# Altium schematic sheet USB-HUB-H.schdoc
size 604 x 431 mm; Symbol: Sheet-Symbol_A0; Device: Sheet-Symbol_A0; @Page Name: USB-HUB-H; @Create Date: 2023-08-03; @Page Count: 1; @Page No: 1; @Project Name: USB-HUB-H; @Schematic Name: Schematic1; @Update Date: 2023-09-07; Company: Drawn by Mr.HanXianzhi; Page Size: A2; Version: V1.0
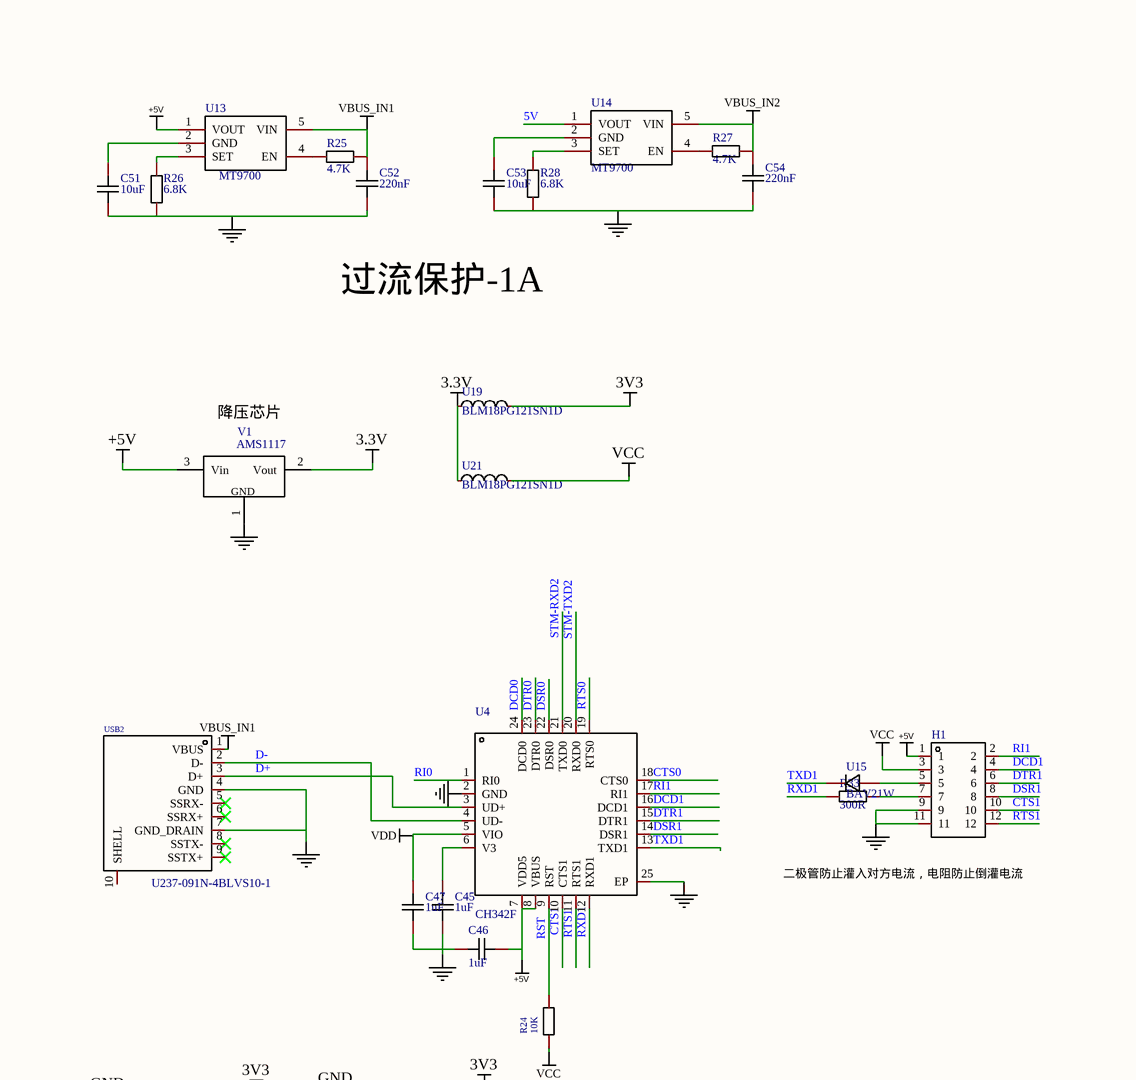
[diagram p0: USB-HUB-H.schdoc, top left]
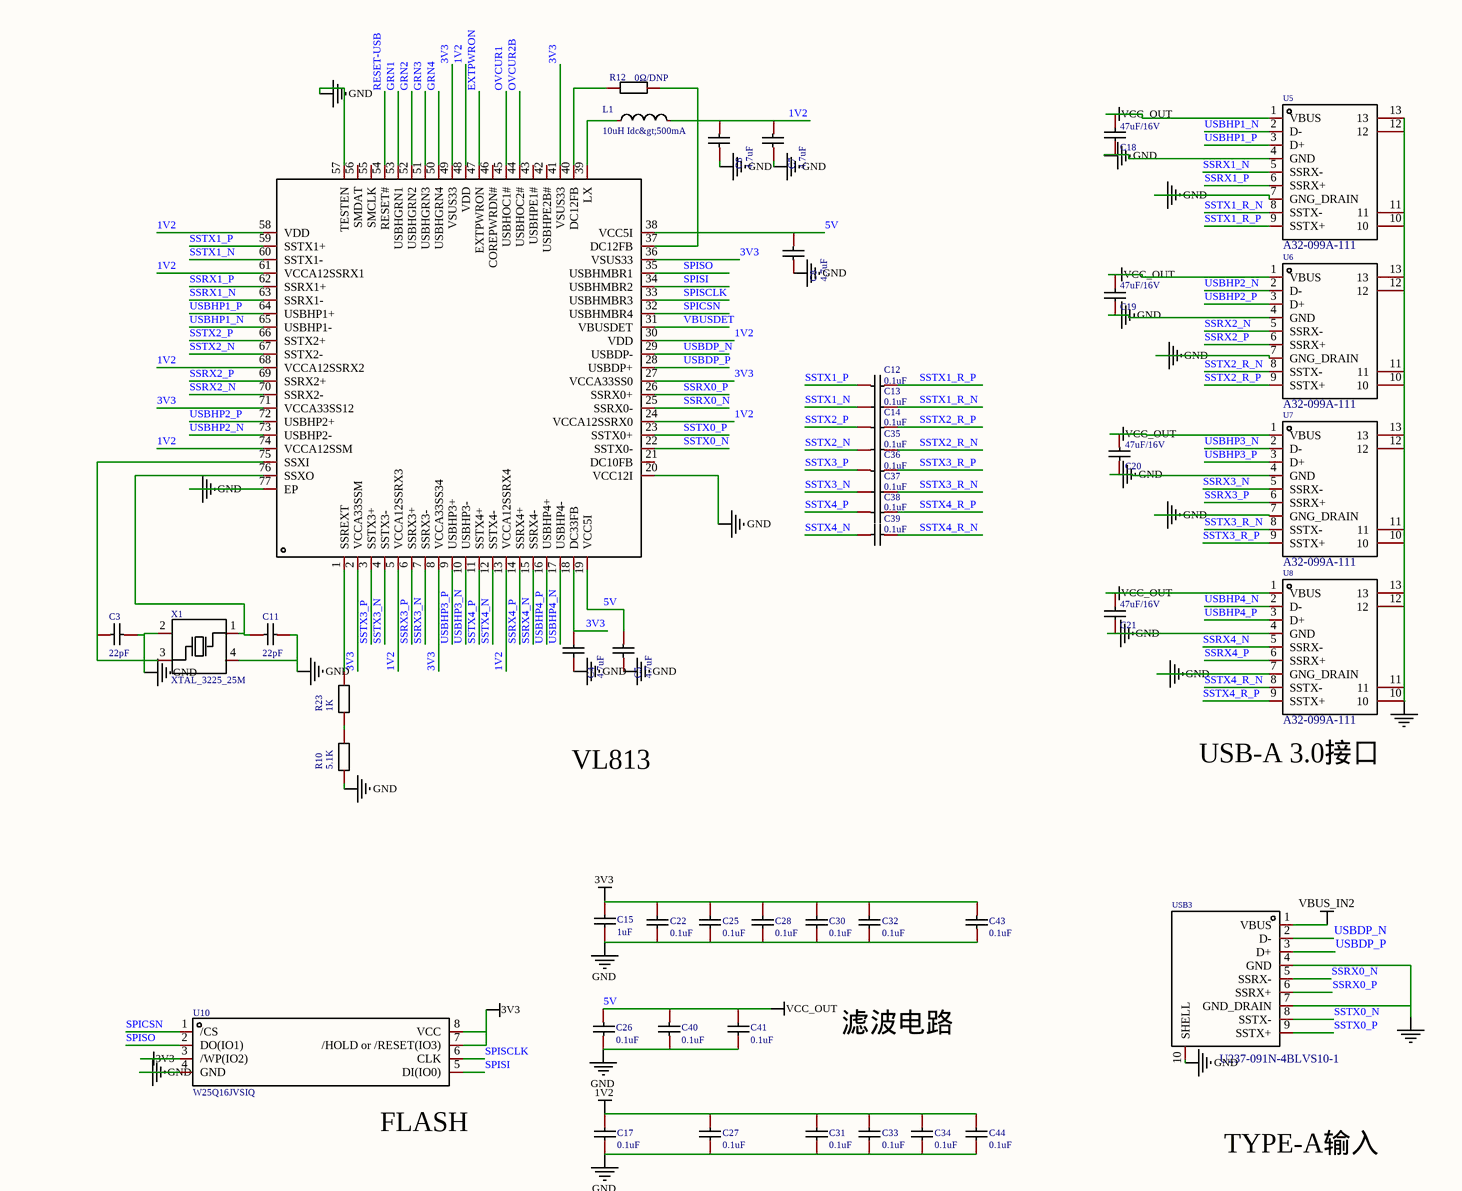
[diagram p1: USB-HUB-H.schdoc, top right]
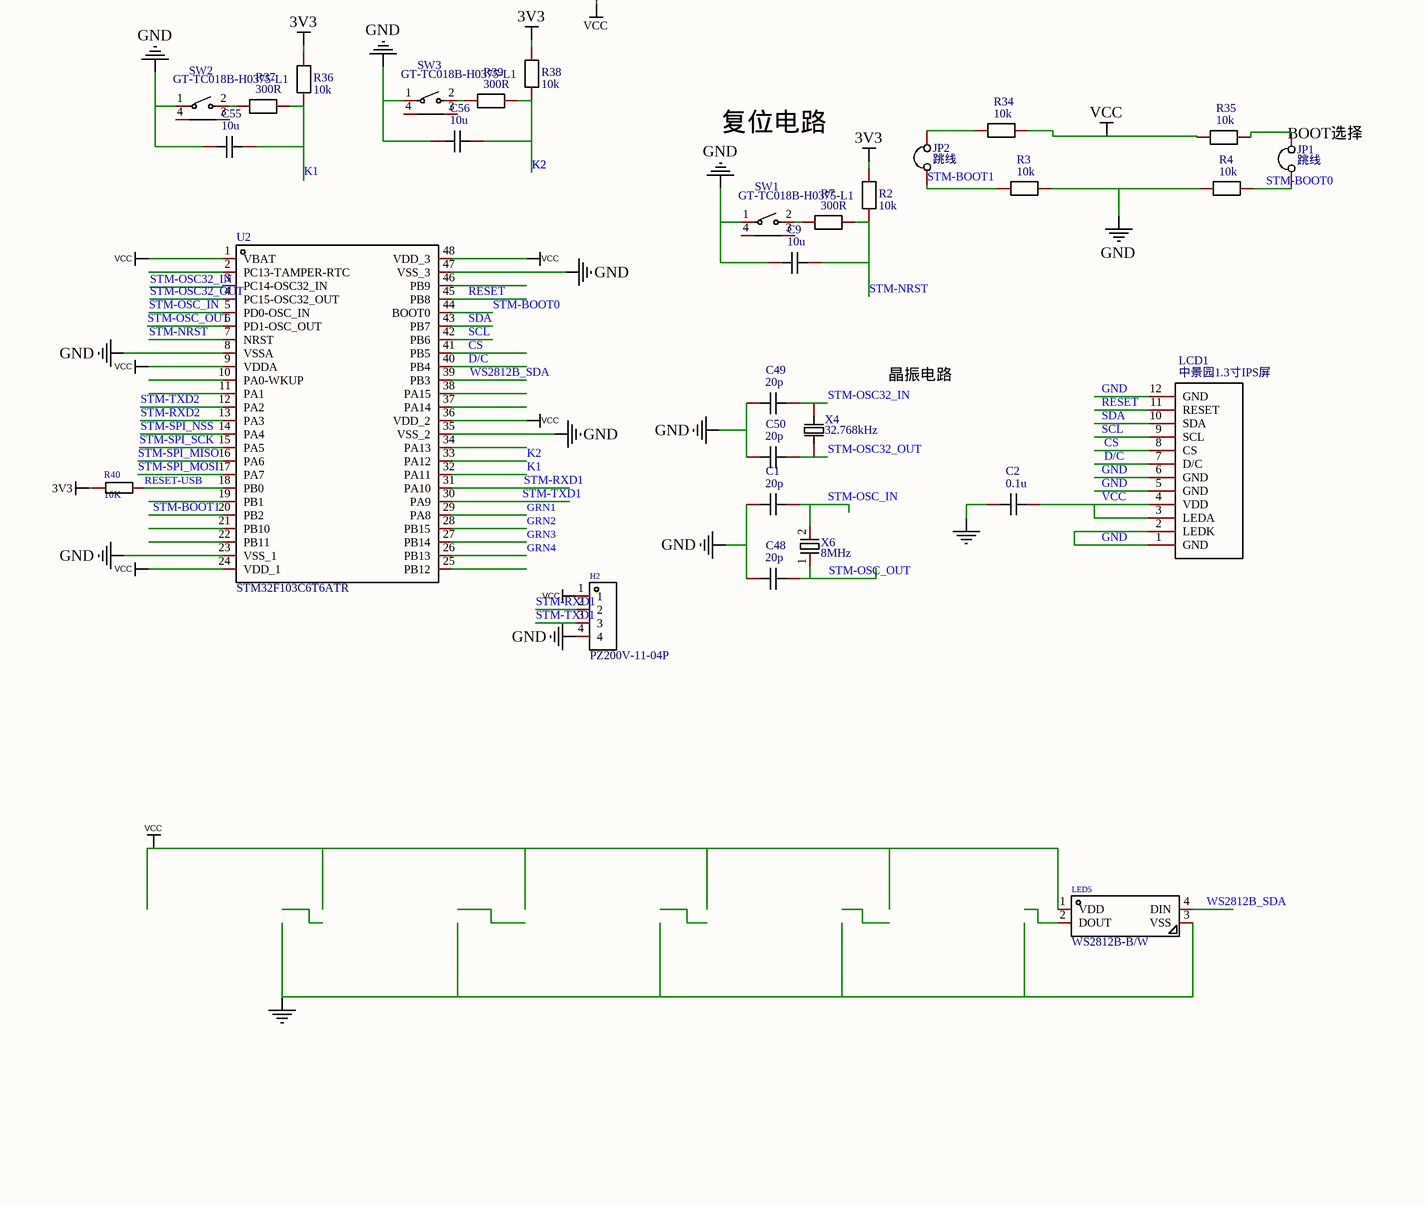
[diagram p2: USB-HUB-H.schdoc, bottom left]
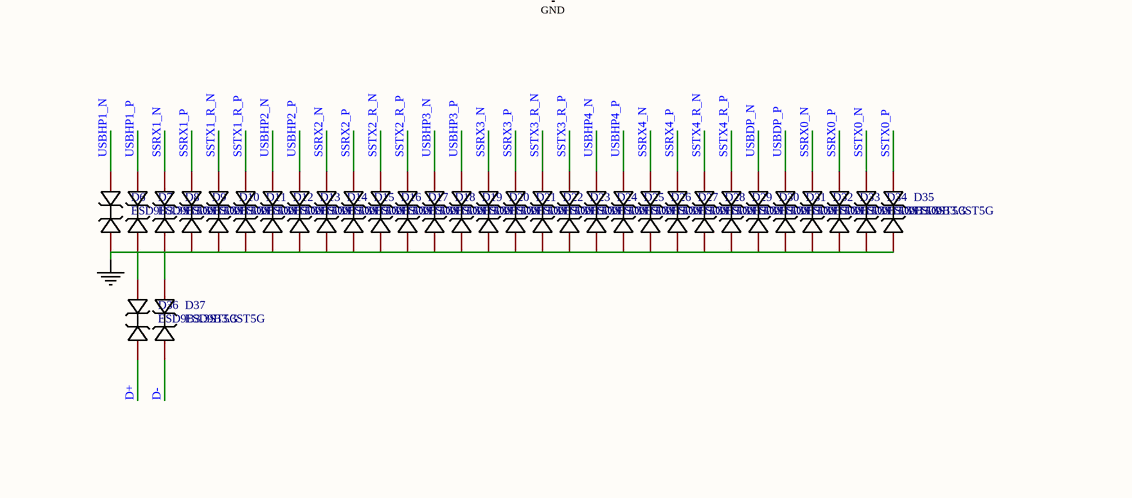
[diagram p3: USB-HUB-H.schdoc, bottom right]

## Parts
C1  20p  [C0603-S]
C2  0.1u  [C0603-S]
C3  22pF  [C0603-S]
C4  4.7uF  [C0603-S]
C5  4.7uF  [C0603-S]
C6  4.7uF  [C0603-S]
C7  4.7uF  [C0603-S]
C8  4.7uF  [C0603-S]
C9  10u  [C0603-S]
C11  22pF  [C0603-S]
C12  0.1uF  [C0603-S]
C13  0.1uF  [C0603-S]
C14  0.1uF  [C0603-S]
C15  1uF  [C0603-S]
C17  0.1uF  [C0603-S]
C18  47uF/16V  [C0603-S]
C19  47uF/16V  [C0603-S]
C20  47uF/16V  [C0603-S]
C21  47uF/16V  [C0603-S]
C22  0.1uF  [C0603-S]
C25  0.1uF  [C0603-S]
C26  0.1uF  [C0603-S]
C27  0.1uF  [C0603-S]
C28  0.1uF  [C0603-S]
C30  0.1uF  [C0603-S]
C31  0.1uF  [C0603-S]
C32  0.1uF  [C0603-S]
C33  0.1uF  [C0603-S]
C34  0.1uF  [C0603-S]
C35  0.1uF  [C0603-S]
C36  0.1uF  [C0603-S]
C37  0.1uF  [C0603-S]
C38  0.1uF  [C0603-S]
C39  0.1uF  [C0603-S]
C40  0.1uF  [C0603-S]
C41  0.1uF  [C0603-S]
C43  0.1uF  [C0603-S]
C44  0.1uF  [C0603-S]
C45  1uF  [C0603-S]
C46  1uF  [C0603-S]
C47  1uF  [C0603-S]
C48  20p  [C0603-S]
C49  20p  [C0603-S]
C50  20p  [C0603-S]
C51  10uF  [C0603-S]
C52  220nF  [C0603-S]
C53  10uF  [C0603-S]
C54  220nF  [C0603-S]
C55  10u  [C0603-S]
C56  10u  [C0603-S]
D6  ESD9B3.3ST5G  [SOD-923_L0.8-W0.6-LS1.0-BI-1]
D7  ESD9B3.3ST5G  [SOD-923_L0.8-W0.6-LS1.0-BI-1]
D8  ESD9B3.3ST5G  [SOD-923_L0.8-W0.6-LS1.0-BI-1]
D9  ESD9B3.3ST5G  [SOD-923_L0.8-W0.6-LS1.0-BI-1]
D10  ESD9B3.3ST5G  [SOD-923_L0.8-W0.6-LS1.0-BI-1]
D11  ESD9B3.3ST5G  [SOD-923_L0.8-W0.6-LS1.0-BI-1]
D12  ESD9B3.3ST5G  [SOD-923_L0.8-W0.6-LS1.0-BI-1]
D13  ESD9B3.3ST5G  [SOD-923_L0.8-W0.6-LS1.0-BI-1]
D14  ESD9B3.3ST5G  [SOD-923_L0.8-W0.6-LS1.0-BI-1]
D15  ESD9B3.3ST5G  [SOD-923_L0.8-W0.6-LS1.0-BI-1]
D16  ESD9B3.3ST5G  [SOD-923_L0.8-W0.6-LS1.0-BI-1]
D17  ESD9B3.3ST5G  [SOD-923_L0.8-W0.6-LS1.0-BI-1]
D18  ESD9B3.3ST5G  [SOD-923_L0.8-W0.6-LS1.0-BI-1]
D19  ESD9B3.3ST5G  [SOD-923_L0.8-W0.6-LS1.0-BI-1]
D20  ESD9B3.3ST5G  [SOD-923_L0.8-W0.6-LS1.0-BI-1]
D21  ESD9B3.3ST5G  [SOD-923_L0.8-W0.6-LS1.0-BI-1]
D22  ESD9B3.3ST5G  [SOD-923_L0.8-W0.6-LS1.0-BI-1]
D23  ESD9B3.3ST5G  [SOD-923_L0.8-W0.6-LS1.0-BI-1]
D24  ESD9B3.3ST5G  [SOD-923_L0.8-W0.6-LS1.0-BI-1]
D25  ESD9B3.3ST5G  [SOD-923_L0.8-W0.6-LS1.0-BI-1]
D26  ESD9B3.3ST5G  [SOD-923_L0.8-W0.6-LS1.0-BI-1]
D27  ESD9B3.3ST5G  [SOD-923_L0.8-W0.6-LS1.0-BI-1]
D28  ESD9B3.3ST5G  [SOD-923_L0.8-W0.6-LS1.0-BI-1]
D29  ESD9B3.3ST5G  [SOD-923_L0.8-W0.6-LS1.0-BI-1]
D30  ESD9B3.3ST5G  [SOD-923_L0.8-W0.6-LS1.0-BI-1]
D31  ESD9B3.3ST5G  [SOD-923_L0.8-W0.6-LS1.0-BI-1]
D32  ESD9B3.3ST5G  [SOD-923_L0.8-W0.6-LS1.0-BI-1]
D33  ESD9B3.3ST5G  [SOD-923_L0.8-W0.6-LS1.0-BI-1]
D34  ESD9B3.3ST5G  [SOD-923_L0.8-W0.6-LS1.0-BI-1]
D35  ESD9B3.3ST5G  [SOD-923_L0.8-W0.6-LS1.0-BI-1]
D36  ESD9B3.3ST5G  [SOD-923_L0.8-W0.6-LS1.0-BI-1]
D37  ESD9B3.3ST5G  [SOD-923_L0.8-W0.6-LS1.0-BI-1]
H1  HDR-M_2.54_2x6  [2.54-2*12pin-SMD]  (value not drawn)
H2  PZ200V-11-04P  [HDR-TH_4P-P2.00-V-M]
JP1  跳线  [JUMPER2]
JP2  跳线  [JUMPER2]
L1  10uH Idc&gt;500mA  [L0603]
LCD1  中景园1.3寸IPS屏  [中景园1.3寸IPS屏-原版]
LED5  WS2812B-B/W  [LED-SMD_4P-L5.0-W5.0-BL_TC5050RGB]
R2  10k  [R0603-S]
R3  10k  [R0603-S]
R4  10k  [R0603-S]
R7  300R  [R0603-S]
R10  5.1K  [R0603-S]
R12  0Ω/DNP  [R0603-S]
R23  1K  [R0603-S]
R24  10K  [R0603-S]
R25  4.7K  [R0603-S]
R26  6.8K  [R0603-S]
R27  4.7K  [R0603-S]
R28  6.8K  [R0603-S]
R33  300R  [R0603-S]
R34  10k  [R0603-S]
R35  10k  [R0603-S]
R36  10k  [R0603-S]
R37  300R  [R0603-S]
R38  10k  [R0603-S]
R39  300R  [R0603-S]
R40  10K  [R0603-S]
SW1  GT-TC018B-H0375-L1  [SW-SMD_L4.7-W3.5-P3.35-EH]
SW2  GT-TC018B-H0375-L1  [SW-SMD_L4.7-W3.5-P3.35-EH]
SW3  GT-TC018B-H0375-L1  [SW-SMD_L4.7-W3.5-P3.35-EH]
U2  STM32F103C6T6ATR  [LQFP-48_L7.0-W7.0-P0.50-LS9.0-BL]
U4  CH342F  [VQFN-24_L4.0-W4.0-P0.50-TL-EP2.4]
U5  A32-099A-111  [USB-SMD_A32-099A-111]
U6  A32-099A-111  [USB-SMD_A32-099A-111]
U7  A32-099A-111  [USB-SMD_A32-099A-111]
U8  A32-099A-111  [USB-SMD_A32-099A-111]
U9  VL813(A1)  [VL813 QFN-76 02]  (value not drawn)
U10  W25Q16JVSIQ  [W25Q16]
U13  MT9700  [SOT-23-5_L3.0-W1.7-P0.95-LS2.8-BR]
U14  MT9700  [SOT-23-5_L3.0-W1.7-P0.95-LS2.8-BR]
U15  BAV21W  [SOD-123_L2.7-W1.6-LS3.8-RD]
U19  BLM18PG121SN1D  [L0603]
U21  BLM18PG121SN1D  [L0603]
USB2  U237-091N-4BLVS10-1  [USB3.0-A-SMD_U237-091N-4BLVS10-1]
USB3  U237-091N-4BLVS10-1  [USB3.0-A-SMD_U237-091N-4BLVS10-1]
V1  AMS1117  [SOT89_N]
X1  XTAL_3225_25M  [SMD-4_3225-ACM3225]
X4  32.768kHz  [FC-135R_L3.2-W1.5]
X6  8MHz  [CRYSTAL-SMD_L5.0-W3.2]

## Nets
1V2: C6.1 C7.1 C17.1 C27.1 C31.1 C33.1 C34.1 C44.1 L1.2 R12.1 U9.5(VCCA12SSRX3) U9.13(VCCA12SSRX4) U9.24(VCCA12SSRX0) U9.30(VDD) U9.37(DC12FB) U9.48(VDD) U9.58(VDD) U9.61(VCCA12SSRX1) U9.68(VCCA12SSRX2) U9.74(VCCA12SSM)
3.3V: U19.1 U21.1 V1.2(Vout)
3V3: C4.1 C15.1 C22.1 C25.1 C28.1 C30.1 C32.1 C43.1 R2.2 R36.2 R38.2 R40.2 U9.2(VCCA33SSM) U9.8(VCCA33SS34) U9.18(DC33FB) U9.27(VCCA33SS0) U9.36(VSUS33) U9.41(VSUS33) U9.49(VSUS33) U9.71(VCCA33SS12) U10.3(/WP(IO2)) U10.7(/HOLD_or_/RESET(IO3)) U10.8(VCC) U19.2
5V: C5.1 C8.1 C18.1 C19.1 C20.1 C21.1 C26.1 C40.1 C41.1 U5.1(VBUS) U6.1(VBUS) U7.1(VBUS) U8.1(VBUS) U9.19(VCC5I) U9.38(VCC5I) U14.1(VOUT)  [also labelled VCC_OUT]
+5V: C46.1 H1.1 U4.7(VDD5) U4.8(VBUS) U13.1(VOUT) V1.3(Vin)
GND: C1.1 C2.1 C3.2 C4.2 C5.2 C6.2 C7.2 C8.2 C9.1 C11.2 C15.2 C17.2 C18.2 C19.2 C20.2 C21.2 C22.2 C25.2 C26.2 C27.2 C28.2 C30.2 C31.2 C32.2 C33.2 C34.2 C40.2 C41.2 C43.2 C44.2 C48.1 C49.1 C50.1 C55.1 C56.1 H2.4 LCD1.1(GND) LCD1.2(LEDK) LCD1.5(GND) LCD1.6(GND) LCD1.12(GND) R3.2 R4.1 R10.2 SW1.1 SW2.1 SW3.1 U2.8(VSSA) U2.23(VSS_1) U2.35(VSS_2) U2.47(VSS_3) U5.4(GND) U5.7(GNG_DRAIN) U6.4(GND) U6.7(GNG_DRAIN) U7.4(GND) U7.7(GNG_DRAIN) U8.4(GND) U8.7(GNG_DRAIN) U9.20(VCC12I) U9.57(TESTEN) U9.77(EP) U10.4(GND) USB3.10(SHELL) V1.1(GND) X1.2(GND) X1.4(GND)
NetC45_1: C45.1 C46.2 C47.1 C51.1 C52.1 C53.1 C54.1 D6.1 D7.1 D8.1 D9.1 D10.1 D11.1 D12.1 D13.1 D14.1 D15.1 D16.1 D17.1 D18.1 D19.1 D20.1 D21.1 D22.1 D23.1 D24.1 D25.1 D26.1 D27.1 D28.1 D29.1 D30.1 D31.1 D32.1 D33.1 D34.1 D35.1 D36.1 D37.2 H1.9 H1.11 LED5.3(VSS) R26.1 R28.1 U4.2(GND) U4.25(EP) U5.10 U5.11 U5.12 U5.13 U6.10 U6.11 U6.12 U6.13 U7.10 U7.11 U7.12 U7.13 U8.10 U8.11 U8.12 U8.13 USB2.4(GND) USB2.7(GND_DRAIN) USB3.4(GND) USB3.7(GND_DRAIN)
VBUS_IN1: C52.2 R25.2 U13.5(VIN) USB2.1(VBUS)
VBUS_IN2: C54.2 R27.2 U14.5(VIN) USB3.1(VBUS)
VCC: C2.2 H1.3 H2.1 LCD1.3(LEDA) LCD1.4(VDD) LED5.1(VDD) R24.2 R34.2 R35.1 U2.1(VBAT) U2.9(VDDA) U2.24(VDD_1) U2.36(VDD_2) U2.48(VDD_3) U21.2
VDD: C47.2 U4.5(VIO)
CS: LCD1.8(CS) U2.41(PB5)
CTS0: U4.18(CTS0)
CTS1: H1.10 U4.10(CTS1)
D+: D36.2 U4.3(UD+) USB2.3(D+)
D-: D37.1 U4.4(UD-) USB2.2(D-)
D/C: LCD1.7(D/C) U2.40(PB4)
DCD0: U4.24(DCD0)
DCD1: H1.4 U4.16(DCD1)
DSR0: U4.22(DSR0)
DSR1: H1.8 U4.14(DSR1)
DTR0: U4.23(DTR0)
DTR1: H1.6 U4.15(DTR1)
EXTPWRON: U9.47(EXTPWRON)
GRN1: U2.29(PA8) U9.53(USBHGRN1)
GRN2: U2.28(PB15) U9.52(USBHGRN2)
GRN3: U2.27(PB14) U9.51(USBHGRN3)
GRN4: U2.26(PB13) U9.50(USBHGRN4)
K1: C55.2 R36.1 R37.2 U2.32(PA11)
K2: C56.2 R38.1 R39.2 U2.33(PA12)
OVCUR1: U9.45(USBHOC1#)
OVCUR2B: U9.44(USBHOC2#)
RESET: LCD1.11(RESET) U2.45(PB8)
RESET-USB: R40.1 U2.18(PB0) U9.54(RESET#)
RI0: U4.1(RI0)
RI1: H1.2 U4.17(RI1)
RST: R24.1 U4.9(RST)
RTS0: U4.19(RTS0)
RTS1: H1.12 U4.11(RTS1)
RXD1: R33.1 U4.12(RXD1)
SCL: LCD1.9(SCL) U2.42(PB6)
SDA: LCD1.10(SDA) U2.43(PB7)
SPICSN: U9.32(USBHMBR4) U10.1(/CS)
SPISCLK: U9.33(USBHMBR3) U10.6(CLK)
SPISI: U9.34(USBHMBR2) U10.5(DI(IO0))
SPISO: U9.35(USBHMBR1) U10.2(DO(IO1))
SSRX0_N: D32.2 U9.25(SSRX0-) USB3.5(SSRX-)
SSRX0_P: D33.2 U9.26(SSRX0+) USB3.6(SSRX+)
SSRX1_N: D8.2 U5.5(SSRX-) U9.63(SSRX1-)
SSRX1_P: D9.2 U5.6(SSRX+) U9.62(SSRX1+)
SSRX2_N: D14.2 U6.5(SSRX-) U9.70(SSRX2-)
SSRX2_P: D15.2 U6.6(SSRX+) U9.69(SSRX2+)
SSRX3_N: D20.2 U7.5(SSRX-) U9.7(SSRX3-)
SSRX3_P: D21.2 U7.6(SSRX+) U9.6(SSRX3+)
SSRX4_N: D26.2 U8.5(SSRX-) U9.15(SSRX4-)
SSRX4_P: D27.2 U8.6(SSRX+) U9.14(SSRX4+)
SSTX0_N: D34.2 U9.22(SSTX0-) USB3.8(SSTX-)
SSTX0_P: D35.2 U9.23(SSTX0+) USB3.9(SSTX+)
SSTX1_N: C13.1 U9.60(SSTX1-)
SSTX1_P: C12.1 U9.59(SSTX1+)
SSTX1_R_N: C13.2 D10.2 U5.8(SSTX-)
SSTX1_R_P: C12.2 D11.2 U5.9(SSTX+)
SSTX2_N: C35.1 U9.67(SSTX2-)
SSTX2_P: C14.1 U9.66(SSTX2+)
SSTX2_R_N: C35.2 D16.2 U6.8(SSTX-)
SSTX2_R_P: C14.2 D17.2 U6.9(SSTX+)
SSTX3_N: C37.1 U9.4(SSTX3-)
SSTX3_P: C36.1 U9.3(SSTX3+)
SSTX3_R_N: C37.2 D22.2 U7.8(SSTX-)
SSTX3_R_P: C36.2 D23.2 U7.9(SSTX+)
SSTX4_N: C39.1 U9.12(SSTX4-)
SSTX4_P: C38.1 U9.11(SSTX4+)
SSTX4_R_N: C39.2 D28.2 U8.8(SSTX-)
SSTX4_R_P: C38.2 D29.2 U8.9(SSTX+)
STM-BOOT0: JP1.1 R4.2 U2.44(BOOT0)
STM-BOOT1: JP2.1 R3.1 U2.20(PB2)
STM-NRST: C9.2 R2.1 R7.2 U2.7(NRST)
STM-OSC32_IN: C49.2 U2.3(PC14-OSC32_IN) X4.2
STM-OSC32_OUT: C50.2 U2.4(PC15-OSC32_OUT) X4.1
STM-OSC_IN: C1.2 U2.5(PD0-OSC_IN) X6.2(GND)
STM-OSC_OUT: C48.2 U2.6(PD1-OSC_OUT) X6.1
STM-RXD1: H2.2 U2.31(PA10)
STM-RXD2: U2.13(PA3) U4.21(TXD0)
STM-SPI_MISO: U2.16(PA6)
STM-SPI_MOSI: U2.17(PA7)
STM-SPI_NSS: U2.14(PA4)
STM-SPI_SCK: U2.15(PA5)
STM-TXD1: H2.3 U2.30(PA9)
STM-TXD2: U2.12(PA2) U4.20(RXD0)
TXD1: U4.13(TXD1) U15.1
USBDP_N: D30.2 U9.29(USBDP-) USB3.2(D-)
USBDP_P: D31.2 U9.28(USBDP+) USB3.3(D+)
USBHP1_N: D6.2 U5.2(D-) U9.65(USBHP1-)
USBHP1_P: D7.2 U5.3(D+) U9.64(USBHP1+)
USBHP2_N: D12.2 U6.2(D-) U9.73(USBHP2-)
USBHP2_P: D13.2 U6.3(D+) U9.72(USBHP2+)
USBHP3_N: D18.2 U7.2(D-) U9.10(USBHP3-)
USBHP3_P: D19.2 U7.3(D+) U9.9(USBHP3+)
USBHP4_N: D24.2 U8.2(D-) U9.17(USBHP4-)
USBHP4_P: D25.2 U8.3(D+) U9.16(USBHP4+)
VBUSDET: U9.31(VBUSDET)
WS2812B_SDA: LED5.4(DIN) U2.39(PB3)
NetC3_1: C3.1 U9.75(SSXI) X1.3(OSC2)
NetC11_1: C11.1 U9.76(SSXO) X1.1(OSC1)
NetC45_2: C45.2 U4.6(V3)
NetC51_2: C51.2 U13.2(GND)
NetC53_2: C53.2 U14.2(GND)
NetH1_5: H1.5 U15.2
NetH1_7: H1.7 R33.2
NetJP1_2: JP1.2 R35.2
NetJP2_2: JP2.2 R34.1
NetL1_1: L1.1 U9.39(LX)
NetR7_1: R7.1 SW1.2
NetR10_1: R10.1 R23.2
NetR12_2: R12.2 U9.40(DC12FB)
NetR23_1: R23.1 U9.1(SSREXT)
NetR25_1: R25.1 U13.4(EN)
NetR26_2: R26.2 U13.3(SET)
NetR27_1: R27.1 U14.4(EN)
NetR28_2: R28.2 U14.3(SET)
NetR37_1: R37.1 SW2.2
NetR39_1: R39.1 SW3.2

Not connected (* = marked no-connect by the designer): LED5 2(DOUT); SW1 3 4; SW2 3 4; SW3 3 4; U2 2(PC13-TAMPER-RTC) 10(PA0-WKUP) 11(PA1) 19(PB1) 21(PB10) 22(PB11) 25(PB12) 34(PA13) 37(PA14) 38(PA15) 46(PB9); U9 21(DC10FB) 42(USBHPE2B#) 43(USBHPE1#) 46(COREPWRDN#) 55(SMCLK) 56(SMDAT); USB2 5(SSRX-)* 6(SSRX+)* 8(SSTX-)* 9(SSTX+)* 10(SHELL)

## Notes on the sheet
- 过流保护-1A
- (near V1) 降压芯片
- VL813
- (near U8) USB-A 3.0接口
- 二极管防止灌入对方电流，电阻防止倒灌电流
- 滤波电路
- (near U10) FLASH
- 复位电路
- (near JP1) BOOT选择
- TYPE-A输入
- 晶振电路
- 1
- 2
- 3
- 4
- 5
- 6
- A
- B
- C
- D
- 原理图
- Schematic1
- 创建日期
- 更新日期
- 2023-08-03
- 2023-09-07
- 审阅
- 绘制
- 图页
- USB-HUB-H
- 物料编码
- 版本
- 尺寸
- 页
- 共
- V1.0
- A2
- Drawn by Mr.HanXianzhi

## Library data of the parts
C1 C48-C50 = 20p: Convert to PCB: yes; Origin Footprint: C0603; Name: 20p; Symbol: 20p; Device: 20p; Add into BOM: yes
C2 = 0.1u: Convert to PCB: yes; Origin Footprint: C0603; Name: 0.1u; Symbol: 0.1u; Device: 0.1u; Add into BOM: yes
C3 C11 = 22pF: Manufacturer: FH; Manufacturer Part: 0603F104M500NT; Convert to PCB: yes; Origin Footprint: C0603; Name: 22pF; Symbol: 22pF; Device: 22pF; Supplier: LCSC; Supplier Part: C42998; JLCPCB Part Class: Extended Part; Add into BOM: yes
C4-C8 = 4.7uF: Manufacturer: FH; Manufacturer Part: 0603F104M500NT; Convert to PCB: yes; Origin Footprint: C0603; Name: 4.7uF; Symbol: 4.7uF; Device: 4.7uF; Supplier: LCSC; Supplier Part: C42998; JLCPCB Part Class: Extended Part; Add into BOM: yes
C9 C55 C56 = 10u: Convert to PCB: yes; Origin Footprint: C0603; Name: 10u; Symbol: 10u; Device: 10u; Add into BOM: yes
C12-C14 C17 C22 C25-C28 C30-C41 C43 C44 = 0.1uF: Manufacturer: FH; Manufacturer Part: 0603F104M500NT; Convert to PCB: yes; Origin Footprint: C0603; Name: 0.1uF; Symbol: 0.1uF; Device: 0.1uF; Supplier: LCSC; Supplier Part: C42998; JLCPCB Part Class: Extended Part; Add into BOM: yes
C15 = 1uF: Manufacturer: FH; Manufacturer Part: 0603F104M500NT; Convert to PCB: yes; Origin Footprint: C0603; Name: 1uF; Symbol: 1uF; Device: 1uF; Supplier: LCSC; Supplier Part: C42998; JLCPCB Part Class: Extended Part; Add into BOM: yes
C18-C21 = 47uF/16V: Manufacturer: FH; Manufacturer Part: 0603F104M500NT; Convert to PCB: yes; Origin Footprint: C5*5; Name: 47uF/16V; Symbol: 47uF/16V; Device: 47uF/16V; Supplier: LCSC; Supplier Part: C42998; JLCPCB Part Class: Extended Part; Add into BOM: yes
C45-C47 C51-C54 = CAP_0603: Symbol: CapAcitance; Convert to PCB: yes; Device: CAP_0603; Add into BOM: yes; Supplier Footprint: 0603
  C45-C47: Name: 1uF; Value: 1uF
  C51 C53: Name: 10uF; Value: 10uF
  C52 C54: Name: 220nF; Value: 220nF
D6-D37 = ESD9B3.3ST5G: 极性:双向;反向截止电压(Vrwm):3.3V;击穿电压(VBR):5V;峰值脉冲电流(Ipp)@8/20us:2A;钳位电压(Vc)@Ipp:11.5V;峰值脉冲功率(Ppp)@8/20us:-;结电容(Cj)@1MHz:15pF@1MHz;工作温度:-55℃~+150℃@(Tj);; Manufacturer: onsemi(安森美); Add into BOM: yes; Polarity: 双向; Reverse Stand-Off Voltage (Vrwm): 3.3V; Breakdown Voltage (VBR): 5V; Peak Pulse Current(Ipp)@8/20us: 2A; Clamping Voltage@Ipp: 11.5V; Name: ESD9B3.3ST5G; Symbol: ESD9B3.3ST5G; Device: ESD9B3.3ST5G; LCSC Part Name: ESD9B3.3ST5G; Supplier Part: C96512; Manufacturer Part: ESD9B3.3ST5G; Supplier Footprint: SOD-923-2; Datasheet: https://atta.szlcsc.com/upload/public/pdf/source/20170322/1490151675931.PDF; Supplier: LCSC; Convert to PCB: yes; Peak Pulse Power(Ppp)@8/20us: -; Junction Capacitance(Cj)@1MHz: 15pF@1MHz; Operating Temperature: -55℃~+150℃@(Tj)
H1 = HDR-M_2.54_2x6: Symbol: HDR-M-2.54_2x6; Convert to PCB: yes; Device: HDR-M_2.54_2x6; Add into BOM: yes; Supplier Part: C30734; Supplier Footprint: 插件,P=2.54mm; JLCPCB Part Class: 扩展库
H2 = PZ200V-11-04P: 排数:单排;总PIN位数:4;间距:2mm;插针结构:1x4P;行距:-;安装类型:直插;圆针/方针:方针;额定电流:-;额定电压:-;配合针长度:3.9mm;塑高:2mm;端接针长度:2.8mm;触头材质:黄铜;触头镀层:-;工作温度范围:-40℃~+105℃;焊接温度(最大值):-;颜色:黑色;; Manufacturer: XFCN(兴飞); Add into BOM: yes; Pitch: 2mm; Pin Structure: 1x4P; Circluar Pins/Square Pins: 方针; Name: PZ200V-11-04P; Symbol: PZ200V-11-04P; Device: PZ200V-11-04P; LCSC Part Name: 2mm 1x4P 直插 方针; Supplier Part: C541858; Manufacturer Part: PZ200V-11-04P; Supplier Footprint: 直插,P=2mm; Supplier: LCSC; Convert to PCB: yes; Number of Rows: 单排; Number of Pins: 4; Row Spacing: -; Mounting Type: 直插; Current Rating (Max): -; Voltage Rating (Max): -; Length of Mating Pin: 3.9mm; Insulation Height: 2mm; Length of End Connection Pin: 2.8mm; Contact Material: 黄铜; Contact Plating: -; Operating Temperature Range: -40℃~+105℃; Welding Temperature (Max): -; Color: 黑色
JP1 JP2 = 跳线: Add into BOM: yes; Name: 跳线; Symbol: 跳线; Device: 跳线; Convert to PCB: yes; Origin Footprint: JUMPER2; Origin Footprint 2: JUMPER2
L1 = 10uH Idc>500mA: Manufacturer Part: VHF160808H33NJT; Manufacturer: FH; Convert to PCB: yes; Origin Footprint: INDUCTOR; Name: 10uH Idc&gt;500mA; Symbol: 10uH Idc&gt;500mA; Device: 10uH Idc>500mA; Supplier: LCSC; Supplier Part: C90209; JLCPCB Part Class: Extended Part; Add into BOM: yes
LCD1 = 中景园1.3寸IPS屏: Convert to PCB: yes; Name: 中景园1.3寸IPS屏; Symbol: 中景园1.3寸IPS屏; Device: 中景园1.3寸IPS屏; Add into BOM: yes; Origin Footprint: 中景园1.3寸IPS屏-原版
LED5 = WS2812B-B/W: 发光颜色:RGB三色;; Manufacturer: worldsemi; Add into BOM: yes; Emitted Color: RGB三色; Name: WS2812B-B/W; Symbol: WS2812B-B; Device: WS2812B-B/W; LCSC Part Name: RGB三色 （注意防潮，请查阅规格书中对应具体内容）; Supplier Part: C114586; Manufacturer Part: WS2812B-B/W; Supplier Footprint: SMD5050; Datasheet: https://atta.szlcsc.com/upload/public/pdf/source/20200615/C114586_26EB6813EC9F2A3F6C7FBB2AD75DE01F.pdf; Supplier: LCSC; Convert to PCB: yes
R2-R4 R34-R36 R38 = 10k: Convert to PCB: yes; Origin Footprint: R0603; Name: 10k; Symbol: 10k; Device: 10k; Add into BOM: yes
R7 R37 R39 = 300R: Convert to PCB: yes; Origin Footprint: R0603; Name: 300R; Symbol: 300R; Device: 300R; Add into BOM: yes
R10 = 5.1K: Manufacturer: Guangdong Fenghua Advanced Tech; Manufacturer Part: RS-03K1002FT; Resistance: 10K; Convert to PCB: yes; Origin Footprint: R0603; Name: 5.1K; Symbol: 5.1K; Device: 5.1K; Supplier: LCSC; Supplier Part: C115324; Add into BOM: yes
R12 = 0Ω/DNP: Manufacturer: Guangdong Fenghua Advanced Tech; Manufacturer Part: RS-03K1002FT; Resistance: 10K; Convert to PCB: yes; Origin Footprint: R0603; Name: 0Ω/DNP; Symbol: 0Ω/DNP; Device: 0Ω/DNP; Supplier: LCSC; Supplier Part: C115324; Add into BOM: yes
R23 = 1K: Manufacturer: Guangdong Fenghua Advanced Tech; Manufacturer Part: RS-03K1002FT; Resistance: 10K; Convert to PCB: yes; Origin Footprint: R0603; Name: 1K; Symbol: 1K; Device: 1K; Supplier: LCSC; Supplier Part: C115324; Add into BOM: yes
R24 R40 = 10K: Manufacturer: Guangdong Fenghua Advanced Tech; Manufacturer Part: RS-03K1002FT; Convert to PCB: yes; Origin Footprint: R0603; Name: 10K; Symbol: 10K; Device: 10K; Supplier: LCSC; Supplier Part: C115324; Resistance: 10K; Add into BOM: yes
R25-R28 R33 = Res_0603: Symbol: 电阻; Convert to PCB: yes; Device: Res_0603; Add into BOM: yes; Supplier Footprint: 0603
  R25 R27: Name: 4.7K; Value: 4.7K
  R26 R28: Name: 6.8K; Value: 6.8K
  R33: Name: 300R; Value: 300R
SW1-SW3 = GT-TC018B-H0375-L1: Manufacturer: G-Switch(品赞); Convert to PCB: yes; Name: GT-TC018B-H0375-L1; Symbol: GT-TC018B-H0375-L1; Device: GT-TC018B-H0375-L1; Supplier: LCSC; Supplier Part: C2762970; Manufacturer Part: GT-TC018B-H0375-L1; JLCPCB Part Class: Extended Part; Add into BOM: yes; Origin Footprint: SW-SMD_L4.7-W3.5-P3.35-EH
U2 = STM32F103C6T6ATR: CPU内核:ARM Cortex-M3;CPU最大主频:72MHz;程序存储容量:32KB;程序存储器类型:FLASH;RAM总容量:10KB;GPIO端口数量:37;; Manufacturer: ST(意法半导体); Add into BOM: yes; CPU Maximum Speed: 72MHz; Operating Voltage Range: 2V~3.6V; Program Storage Size: 32KB; Program Memory Type: FLASH; RAM Size: 10KB; GPIO Ports Number: 37; ADC (Bit): 12bit; Universal Serial Bus: 有; Peripheral/Function: DMA；片载温度传感器；PWM; Name: STM32F103C6T6ATR; Symbol: STM32F103C6T6ATR; Device: STM32F103C6T6ATR; LCSC Part Name: ARM Cortex-M3 72MHz; Supplier Part: C2053946; Manufacturer Part: STM32F103C6T6ATR; Supplier Footprint: LQFP-48(7x7); Datasheet: https://atta.szlcsc.com/upload/public/pdf/source/20180517/C222375_CD94F50F0FE19DB30C5D4A742BF83DA8.pdf; Supplier: LCSC; Convert to PCB: yes; CPU Core: ARM Cortex-M3; EEPROM: -; DAC (Bit): -; PWM (Bit): -; Internal Comparator: -; communication protocol: -; Watchdog: 有; Real-Time Clock: -; Infrared Data Association: 有; Low-Voltage Detect: 有; CCP Capture/Compare: -; Secure Digital Input and Output: -; Direct Memory Access: 有; Internal Oscillator: 有; Operating Temperature Range: -40℃~+85℃
U4 = CH342F: Manufacturer: WCH(南京沁恒); Add into BOM: yes; Name: CH342F; Symbol: CH342F; Device: CH342F; LCSC Part Name: CH342F; Supplier Part: C2841530; Manufacturer Part: CH342F; Supplier Footprint: QFN-24(4x4); Datasheet: https://atta.szlcsc.com/upload/public/pdf/source/20211010/C2841530_D42D355CB13BEB69D3F27EE40180C477.pdf; Supplier: LCSC; Convert to PCB: yes
U5-U8 = A32-099A-111: 连接器类型:Type-A;标准:USB 3.0;公母:母座;触点数量:9;端口数量:1;安装方式:沉板;额定电流 - 电源:1.5A;触头材质:青铜;触头镀层:金;工作温度范围:-40℃~+85℃;焊接温度(最大值):260℃;; Manufacturer: XKB Connectivity(中国星坤); Add into BOM: yes; Connector Type: Type-A; Gender: 母座; Number of Contacts: 9; Number of Ports: 1; Current Rating - Power (Max): 1.5A; Welding Temperature (Max): 260℃; Name: A32-099A-111; Symbol: A32-099A-111; Device: A32-099A-111; LCSC Part Name: Type-A 母座 沉板; Supplier Part: C2923581; Manufacturer Part: A32-099A-111; Supplier Footprint: SMD; Supplier: LCSC; Convert to PCB: yes; Standard: USB 3.0; Mounting Style: 沉板; Contact Material: 青铜; Contact Plating: 金; Operating Temperature Range: -40℃~+85℃; link: https://atta.szlcsc.com/upload/public/pdf/source/20211209/9FB78B3897D252F7644FD9956EF9327F.pdf
U9 = VL813(A1): Manufacturer: VIA(台湾威盛电子); Add into BOM: yes; Origin Footprint: QFN-76; Name: VL813(A1); Symbol: VL813(A1); Device: VL813(A1); LCSC Part Name: VL813(A1); Supplier Part: C209755; Manufacturer Part: VL813(A1); Supplier Footprint: QFN-76_9x9x04P; JLCPCB Part Class: Extended Part; Datasheet: https://atta.szlcsc.com/upload/public/pdf/source/20180420/C209755_1BF0F45DD04BFA941B7FD492504FA511.pdf; Supplier: LCSC; Convert to PCB: yes; Type: -; Protocol: -; Number of Drivers/Receivers: -; Data Rate: -; Supply Voltage: -
U10 = W25Q16JVSIQ: Manufacturer: Winbond Elec; Manufacturer Part: W25Q16FWSSIQ; Convert to PCB: yes; Origin Footprint: SOIC-8_L5.3-W5.3-P1.27-LS8.0-BL; Name: W25Q16JVSIQ; Symbol: W25Q16JVSIQ; Device: W25Q16JVSIQ; Supplier: LCSC; Supplier Part: C377629; JLCPCB Part Class: Extended Part; Add into BOM: yes
U13 U14 = MT9700: 低功耗负载开关/USB电源开关/限流保护开关; Manufacturer: 西安航天民芯; Add into BOM: yes; Name: MT9700; Symbol: MT9700; Device: MT9700; LCSC Part Name: MT9700; Supplier Part: C89855; Manufacturer Part: MT9700; Supplier Footprint: SOT-23-5; Datasheet: https://atta.szlcsc.com/upload/public/pdf/source/20170418/1492481333031.pdf; Supplier: LCSC; Convert to PCB: yes
U15 = BAV21W_C2903907: 二极管配置:独立式;直流反向耐压(Vr):250V;平均整流电流(Io):250mA;正向压降(Vf):1.25V@0.25A;反向电流(Ir):100nA@250V;; Manufacturer: GOODWORK(固得沃克); Add into BOM: yes; Diode Configuration: 独立式; Reverse Voltage (Vr): 250V; Average Rectified Current (Io): 250mA; Name: BAV21W; Symbol: BAV21W_C2903907; Device: BAV21W_C2903907; LCSC Part Name: 250V 250mA 1.25V@0.25A; Supplier Part: C2903907; Manufacturer Part: BAV21W; Supplier Footprint: SOD-123; Datasheet: https://atta.szlcsc.com/upload/public/pdf/source/20211009/F19AC3551829669EC6F05286F58835F5.pdf; Supplier: LCSC; Convert to PCB: yes; Forward Voltage (Vf@If): 1.25V@0.25A; Reverse Leakage Current: 100nA@250V
U19 U21 = BLM18PG121SN1D: 标称阻抗@测试频率:120Ω@100MHz;误差:±25%;直流电阻(RDC):50mΩ;额定电流:2A;电路数:1;; Manufacturer: muRata(村田); Symbol: BLM18PG121SN1D_C14709; Add into BOM: yes; Tolerance: ±25%; DC Resistance: 50mΩ; Current Rating: 2A; Circuits: 1; Name: BLM18PG121SN1D; Device: BLM18PG121SN1D; LCSC Part Name: 120Ω@100MHz ±25%; Supplier Part: C14709; Manufacturer Part: BLM18PG121SN1D; Supplier Footprint: 0603; Datasheet: https://atta.szlcsc.com/upload/public/pdf/source/20130704/1457706621134.pdf; Supplier: LCSC; Convert to PCB: yes; Impedance @ Frequency: 120Ω@100MHz
USB2 USB3 = U237-091N-4BLVS10-1: 连接器类型:Type-A;标准:USB 3.0;公母:公头;触点数量:9;端口数量:1;安装方式:沉板;额定电流 - 电源:1.8A;触头材质:铜合金;触头镀层:金;工作温度范围:-40℃~+85℃;焊接温度(最大值):260℃;; Manufacturer: XKB Connectivity(中国星坤); Add into BOM: yes; Connector Type: Type-A; Gender: 公头; Number of Contacts: 9; Number of Ports: 1; Current Rating - Power (Max): 1.8A; Welding Temperature (Max): 260℃; Name: U237-091N-4BLVS10-1; Symbol: U237-091N-4BLVS10-1; Device: U237-091N-4BLVS10-1; LCSC Part Name: Type-A 公头 沉板; Supplier Part: C388655; Manufacturer Part: U237-091N-4BLVS10-1; Supplier Footprint: SMD; Supplier: LCSC; Convert to PCB: yes; Standard: USB 3.0; Mounting Style: 沉板; Contact Material: 铜合金; Contact Plating: 金; Operating Temperature Range: -40℃~+85℃
V1 = AMS1117: BOM名称: 稳压芯片; 版权归属: 黎明电子style; Convert to PCB: yes; Name: AMS1117; Symbol: AMS1117; Device: AMS1117; 学习资源: https://lmdzstyle.taobao.com/; Add into BOM: yes; Origin Footprint: SOT89_N
X1 = XTAL_3225_25M: Manufacturer: YXC; Manufacturer Part: X322540MPB4SI; Convert to PCB: yes; Origin Footprint: OSC-SMD_4P-L3.2-W2.5-BL_SIT8008BI; Name: XTAL_3225_25M; Symbol: XTAL_3225_25M; Device: XTAL_3225_25M; Supplier: LCSC; Supplier Part: C9010; JLCPCB Part Class: Extended Part; Add into BOM: yes
X4 = Q13FC1350000400: 频率:32.768kHz;频率公差:±20ppm;负载电容:12.5pF;; Manufacturer: EPSON(爱普生); Add into BOM: yes; Crystal Type: 贴片无源晶振; Frequency Tolerance: ±20ppm; Load Capacitance: 12.5pF; Equivalent Series Resistance (ESR): 70kΩ; Name: 32.768kHz; Symbol: Q13FC1350000400; Device: Q13FC1350000400; LCSC Part Name: 32.768kHz ±20ppm 12.5pF; Supplier Part: C32346; Manufacturer Part: Q13FC1350000400; Supplier Footprint: SMD3215-2P; Datasheet: https://atta.szlcsc.com/upload/public/pdf/source/20190108/C32346_746D6B07EAF90824457A96480007685F.pdf; Supplier: LCSC; Convert to PCB: yes; Value: 32.768kHz; Operating Temperature: -40℃~+85℃
X6 = XC53G2-8.000-F12NJHP: 频率:8MHz;频率公差:±10ppm;负载电容:12pF;; Manufacturer: HCI(杭晶); Add into BOM: yes; Crystal Type: 贴片无源晶振; Frequency Tolerance: ±10ppm; Frequency Stability: ±30ppm; Load Capacitance: 12pF; Equivalent Series Resistance (ESR): 80Ω; Name: 8MHz; Symbol: XC53G2-8.000-F12NJHP; Device: XC53G2-8.000-F12NJHP; LCSC Part Name: 8MHz ±10ppm 12pF; Supplier Part: C2842269; Manufacturer Part: XC53G2-8.000-F12NJHP; Supplier Footprint: SMD5032-2P; Datasheet: https://atta.szlcsc.com/upload/public/pdf/source/20220525/EC23E49B695B4258EFCAA7B02392B00B.pdf; Supplier: LCSC; Convert to PCB: yes; Value: 8MHz; Operating Temperature: -40℃~+85℃